# EAGLE design ModulCentralny (EAGLE 9.6.2)
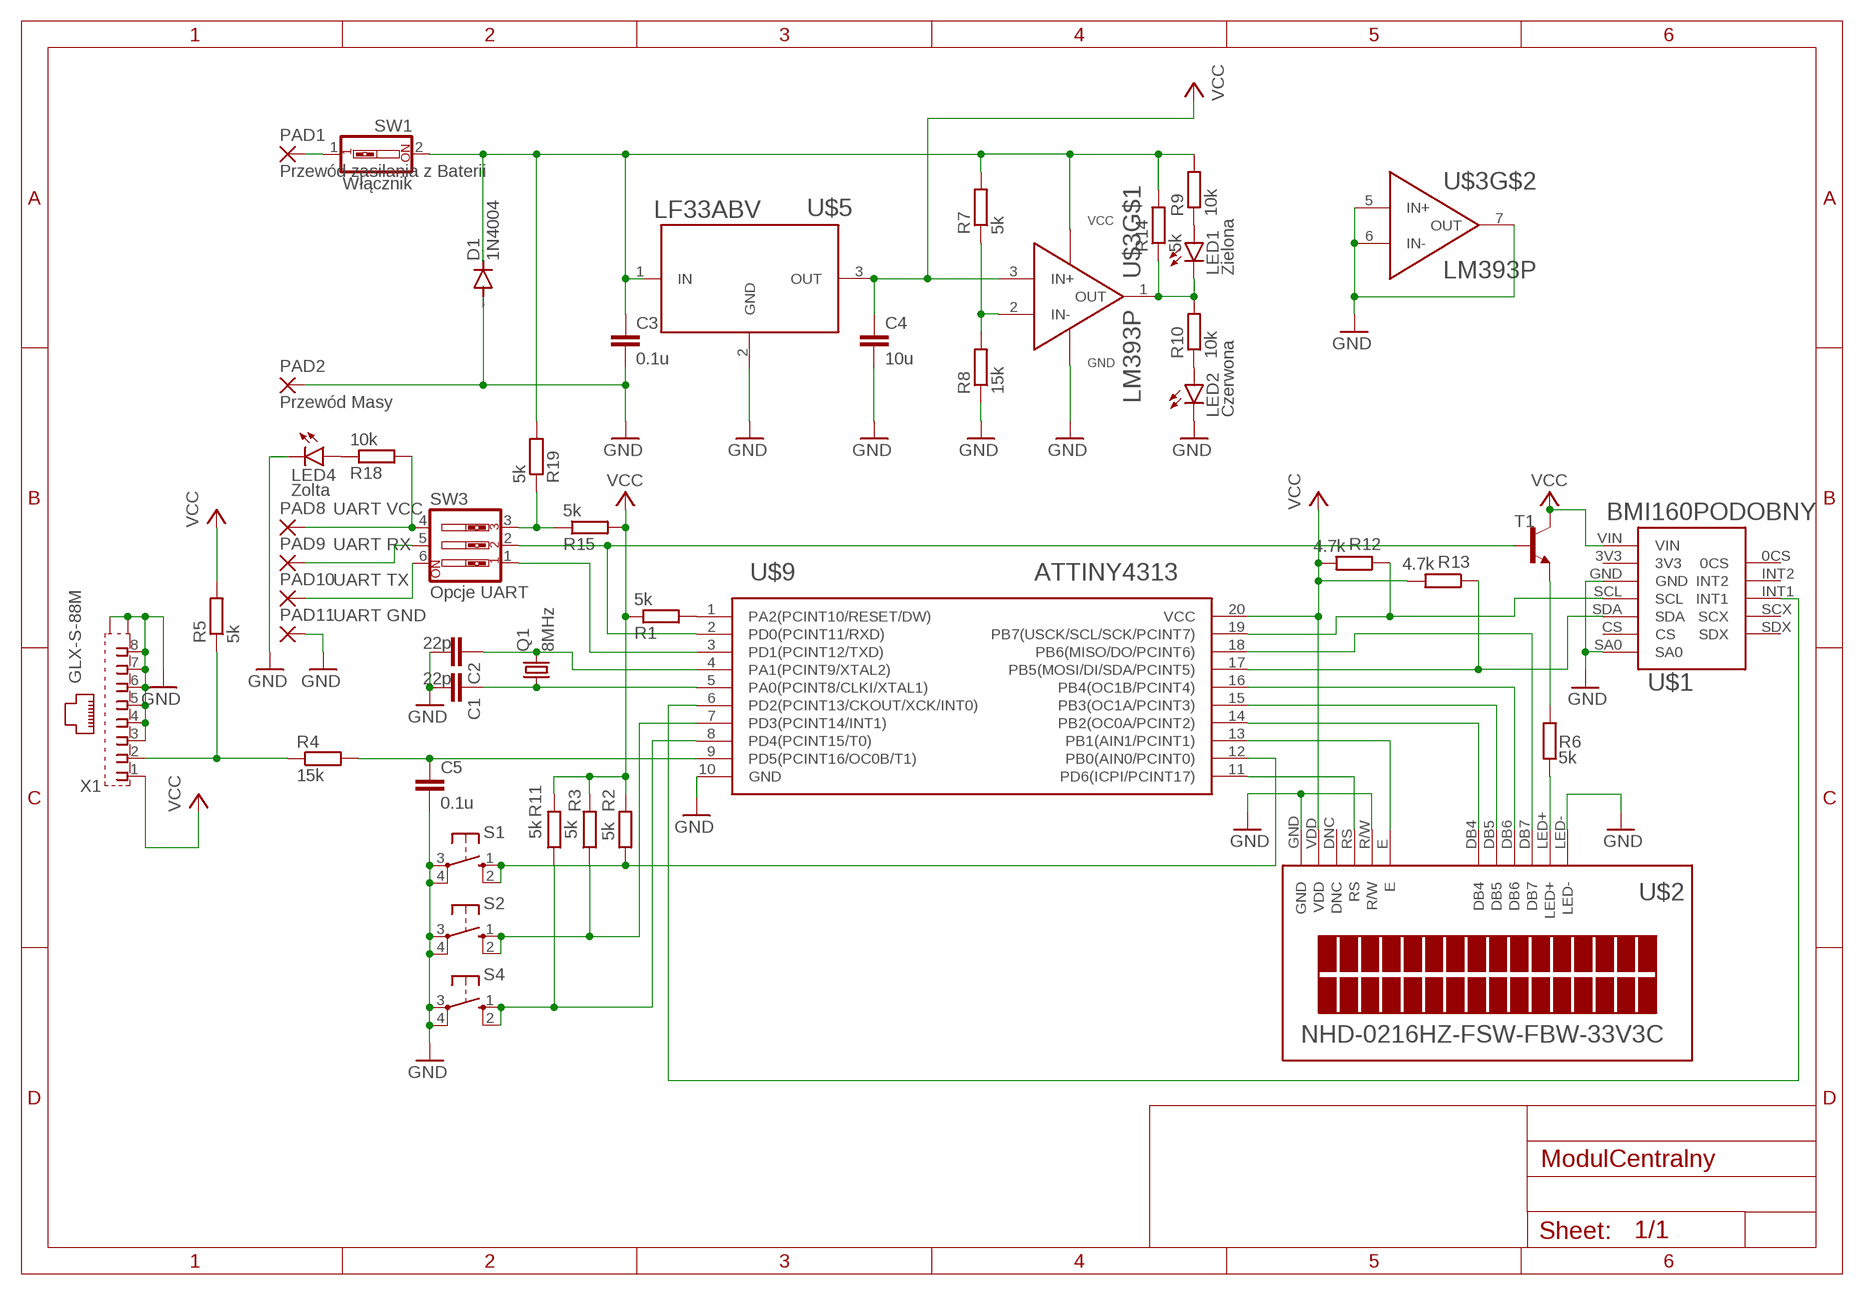
[diagram p0: schematic, sheet 1]

## Parts
C1  22p  C2,5-3  [C2.5-3]
C2  22p  C2,5-3  [C2.5-3]
C3  0.1u  C2,5-3  [C2.5-3]
C4  10u  C2,5-3  [C2.5-3]
C5  0.1u  C2,5-3  [C2.5-3]
D1  1N4004  [DO41-10]
LED1  Zielona  LED5MM  [LED5MM]
LED2  Czerwona  LED5MM  [LED5MM]
LED4  Zolta  LED5MM  [LED5MM]
PAD1  Przewód zasilania z Baterii  WIREPAD2,54/1,1  [2,54/1,1]
PAD2  Przewód Masy  WIREPAD2,54/1,1  [2,54/1,1]
PAD8  UART VCC  WIREPAD3,17/1,3  [3,17/1,3]
PAD9  UART RX  WIREPAD3,17/1,3  [3,17/1,3]
PAD10  UART TX  WIREPAD3,17/1,3  [3,17/1,3]
PAD11  UART GND  WIREPAD3,17/1,3  [3,17/1,3]
Q1  8MHz  CRYSTALHC49U70  [HC49U70]
R1  5k  R-EU_0207/7  [0207/7]
R2  5k  R-EU_0207/7  [0207/7]
R3  5k  R-EU_0207/7  [0207/7]
R4  15k  R-EU_0207/7  [0207/7]
R5  5k  R-EU_0207/7  [0207/7]
R6  5k  R-EU_0207/7  [0207/7]
R7  5k  R-EU_0207/7  [0207/7]
R8  15k  R-EU_0207/7  [0207/7]
R9  10k  R-EU_0207/7  [0207/7]
R10  10k  R-EU_0207/7  [0207/7]
R11  5k  R-EU_0207/7  [0207/7]
R12  4.7k  R-EU_0207/7  [0207/7]
R13  4.7k  R-EU_0207/7  [0207/7]
R14  5k  R-EU_0207/7  [0207/7]
R15  5k  R-EU_0207/7  [0207/7]
R18  10k  R-EU_0207/7  [0207/7]
R19  5k  R-EU_0207/7  [0207/7]
S1  10-XX  [B3F-10XX]
S2  10-XX  [B3F-10XX]
S4  10-XX  [B3F-10XX]
SW1  Włącznik  SW_DIP-1  [EDG-01]
SW3  Opcje UART  SW_DIP-3  [EDG-03]
T1  BC547B-NPN-TO92-CBE  [TO92-CBE]
U$1  BMI160PODOBNY  [BMI160MODULE]
U$2  NHD-0216HZ-FSW-FBW-33V3C  [NHD-0216HZ-FSW-FBW-33V3C]
U$3  LM393P  [R-PDIP-T8]
U$5  LF33ABV  [TO-220]
U$9  ATTINY4313  [20P3]
X1  GLX-S-88M  [GLX-S-88M]

## Nets
GND: C1.2 C2.2 C3.2 C4.2 C5.2 D1.A LED2.K(C) LED4.K(C) PAD2.1(P) PAD11.1(P) R8.1 S1.3(P) S1.4(P1) S2.3(P) S2.4(P1) S4.3(P) S4.4(P1) U$1.GND U$1.SA0 U$2.GND U$2.LED- U$2.R/W U$3.4(GND) U$3.5(IN+) U$3.6(IN-) U$3.7(OUT) U$5.2(GND) U$9.10(GND) X1.3 X1.4 X1.5 X1.6 X1.7 X1.8 X1.S1 X1.S2
N$1: R13.1 U$1.SDA U$9.17(PB5(MOSI/DI/SDA/PCINT5))
N$2: C2.1 Q1.2 U$9.4(PA1(PCINT9/XTAL2))
N$3: R1.2 U$9.1(PA2(PCINT10/RESET/DW))
N$4: R11.1 S4.1(S) S4.2(S1) U$9.8(PD4(PCINT15/T0))
N$5: U$2.DB7 U$9.18(PB6(MISO/DO/PCINT6))
N$6: U$2.DB6 U$9.16(PB4(OC1B/PCINT4))
N$7: U$2.DB5 U$9.15(PB3(OC1A/PCINT3))
N$8: U$2.DB4 U$9.14(PB2(OC0A/PCINT2))
N$9: U$2.E U$9.13(PB1(AIN1/PCINT1))
N$10: R4.1 R5.1 X1.2
N$11: PAD1.1(P) SW1.1
N$12: SW3.1 U$9.3(PD1(PCINT12/TXD))
N$13: SW3.2 T1.B U$9.2(PD0(PCINT11/RXD))
N$14: R15.1 R19.1 SW3.3
N$15: C1.1 Q1.1 U$9.5(PA0(PCINT8/CLKI/XTAL1))
N$16: R6.2 U$2.LED+
N$17: C3.1 D1.C R7.2 R9.2 R14.2 R19.2 SW1.2 U$3.8(VCC) U$5.1(IN)
N$18: R12.1 U$1.SCL U$9.19(PB7(USCK/SCL/SCK/PCINT7))
N$19: R7.1 R8.2 U$3.2(IN-)
N$20: LED1.K(C) R10.2 R14.1 U$3.1(OUT)
N$21: LED1.A R9.1
N$22: LED2.A R10.1
N$23: U$2.RS U$9.11(PD6(ICPI/PCINT17))
N$24: U$1.INT1 U$9.6(PD2(PCINT13/CKOUT/XCK/INT0))
N$25: R6.1 T1.E
N$30: C5.1 R4.2 U$9.9(PD5(PCINT16/OC0B/T1))
N$31: R3.1 S2.1(S) S2.2(S1) U$9.7(PD3(PCINT14/INT1))
N$32: R2.1 S1.1(S) S1.2(S1) U$9.12(PB0(AIN0/PCINT0))
N$34: PAD8.1(P) R18.2 SW3.4
N$35: PAD10.1(P) SW3.6
N$36: PAD9.1(P) SW3.5
N$37: LED4.A R18.1
VCC: C4.1 R1.1 R2.2 R3.2 R5.2 R11.2 R12.2 R13.2 R15.2 T1.C U$1.VIN U$2.VDD U$3.3(IN+) U$5.3(OUT) U$9.20(VCC) X1.1
Unconnected: U$1.0CS U$1.3V3 U$1.CS U$1.INT2 U$1.SCX U$1.SDX U$2.DNC

## Library data of the parts
C1-C5 = capacitor-wima:C: CAPACITOR naming: grid - package width
D1 = diode:1N4004: DIODE general purpose rectifier, 1 A
LED1 LED2 LED4 = led:LED: LED OSRAM: - CHIPLED LG R971, LG N971, LY N971, LG Q971, LY Q971, LO R971, LY R971 LH N974, LH R974 LS Q976, LO Q976, LY Q976 LO Q996 - Hyper CHIPLED LW Q18S LB Q993, LB Q99A, LB R99A - SideLED LS A670, LO A670, LY A670, LG A670, LP A670 LB A673, LV A673, LT A673, LW A673 LH A674 LY A675 LS A676, LA A676, LO A676, LY A676, LW A676 LS A679, LY A679, LG A679 - Hyper Micro SIDELED® LS Y876, LA Y876, LO Y876, LY Y876 LT Y87S - SmartLED LW L88C, LW L88S LB L89C, LB L89S, LG L890 LS L89K, LO L89K, LY L89K LS L896, LA L896, LO L896, LY L896 - TOPLED LS T670, LO T670, LY T670, LG T670, LP T670 LSG T670, LSP T670, LSY T670, LOP T670, LYG T670 LG T671, LOG T671, LSG T671 LB T673, LV T673, LT T673, LW T673 LH T674 LS T676, LA T676, LO T676, LY T676, LB T676, LH T676, LSB T676, LW T676 LB T67C, LV T67C, LT T67C, LS T67K, LO T67K, LY T67K, LW E67C LS E67B, LA E67B, LO E67B, LY E67B, LB E67C, LV E67C, LT E67C LW T67C LS T679, LY T679, LG T679 LS T770, LO T770, LY T770, LG T770, LP T770 LB T773, LV T773, LT T773, LW T773 LH T774 LS E675, LA E675, LY E675, LS T675 LS T776, LA T776, LO T776, LY T776, LB T776 LHGB T686 LT T68C, LB T68C - Hyper Mini TOPLED® LB M676 - Mini TOPLED Santana® LG M470 LS M47K, LO M47K, LY M47K Source: http://www.osram.convergy.de LUXEON: - LUMILED® LXK2-PW12-R00, LXK2-PW12-S00, LXK2-PW14-U00, LXK2-PW14-V00 LXK2-PM12-R00, LXK2-PM12-S00, LXK2-PM14-U00 LXK2-PE12-Q00, LXK2-PE12-R00, LXK2-PE12-S00, LXK2-PE14-T00, LXK2-PE14-U00 LXK2-PB12-K00, LXK2-PB12-L00, LXK2-PB12-M00, LXK2-PB14-N00, LXK2-PB14-P00, LXK2-PB14-Q00 LXK2-PR12-L00, LXK2-PR12-M00, LXK2-PR14-Q00, LXK2-PR14-R00 LXK2-PD12-Q00, LXK2-PD12-R00, LXK2-PD12-S00 LXK2-PH12-R00, LXK2-PH12-S00 LXK2-PL12-P00, LXK2-PL12-Q00, LXK2-PL12-R00 Source: www.luxeon.com KINGBRIGHT: KA-3528ASYC Source: www.kingbright.com
PAD1 PAD2 PAD8-PAD11 = wirepad:WIREPAD: Wire PAD connect wire on PCB
Q1 = crystal:CRYSTAL: CRYSTAL; OC_FARNELL: unknown; OC_NEWARK: unknown
R1-R15 R18 R19 = rcl:R-EU_: RESISTOR, European symbol; SPICEPREFIX: R
S1 S2 S4 = switch-omron:10-XX: OMRON SWITCH; MPN: B3F-1000; OC_FARNELL: 176432; OC_NEWARK: 36M3542
SW1 = special:SW_DIP-1: DIP SWITCH
SW3 = special:SW_DIP-3: DIP SWITCH
T1 = transistor:*-NPN-: NPN Transistror BF959 corrected 2008.03.06
U$1 = BezkonataktowyLicznikObrotów:BMI160PODOBNY
U$2 = BezkonataktowyLicznikObrotów:NHD-0216HZ-FSW-FBW-33V3C
U$3 = BezkonataktowyLicznikObrotów:LM393P
U$5 = BezkonataktowyLicznikObrotów:LF33ABV
U$9 = BezkonataktowyLicznikObrotów:ATTINY4313
X1 = con-kycon:GLX-S-88M: Mod. Jack, Right Angle, 8 posiotion, 8 contatcs RJ45 Source: GLX-S-88M.pdf; OC_FARNELL: unknown; OC_NEWARK: unknown

## Board
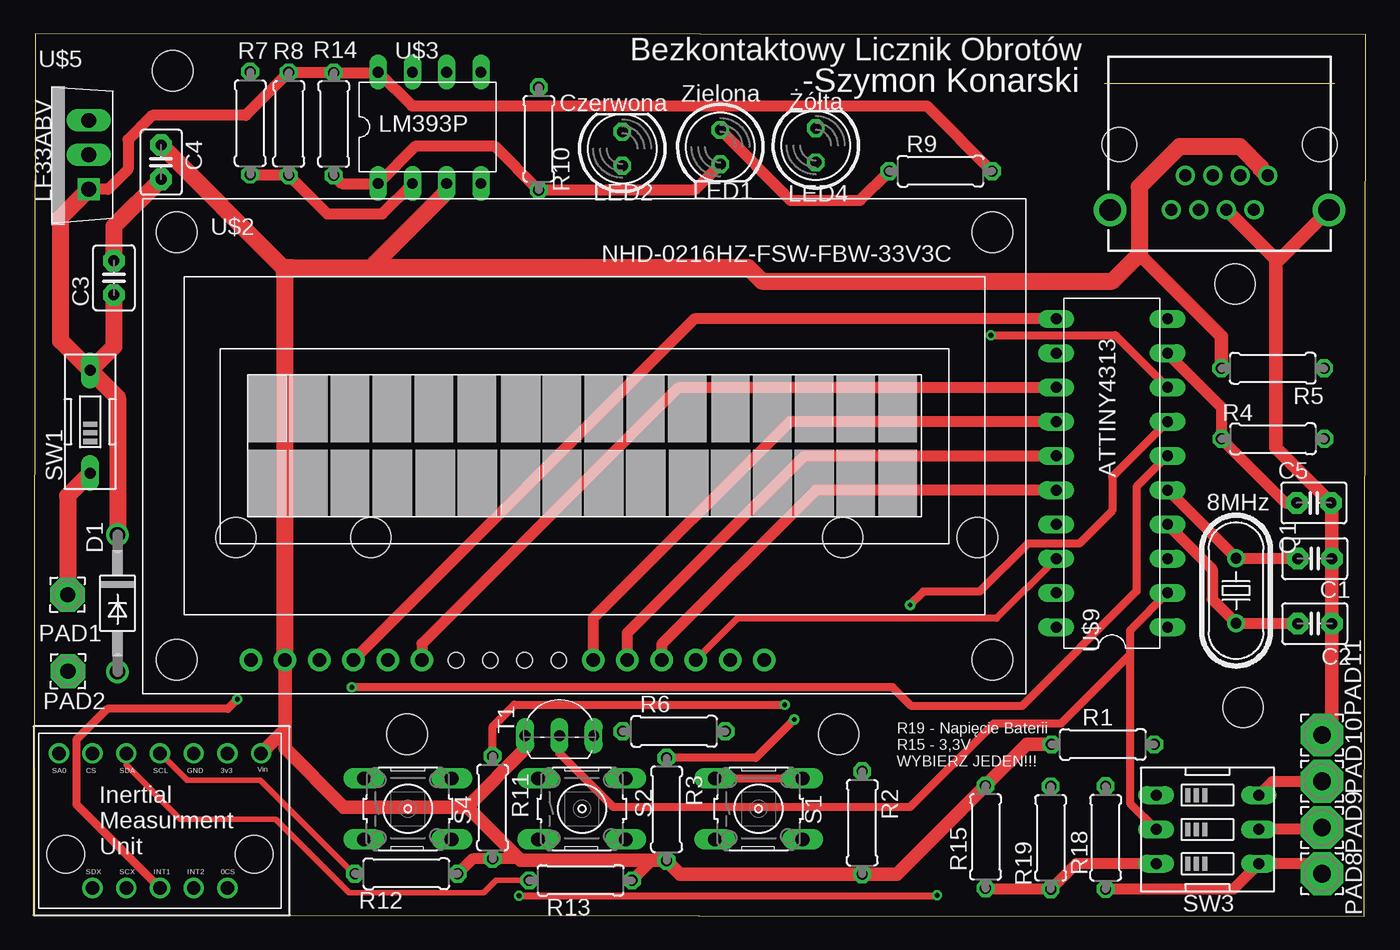
[diagram p1: board, top side]
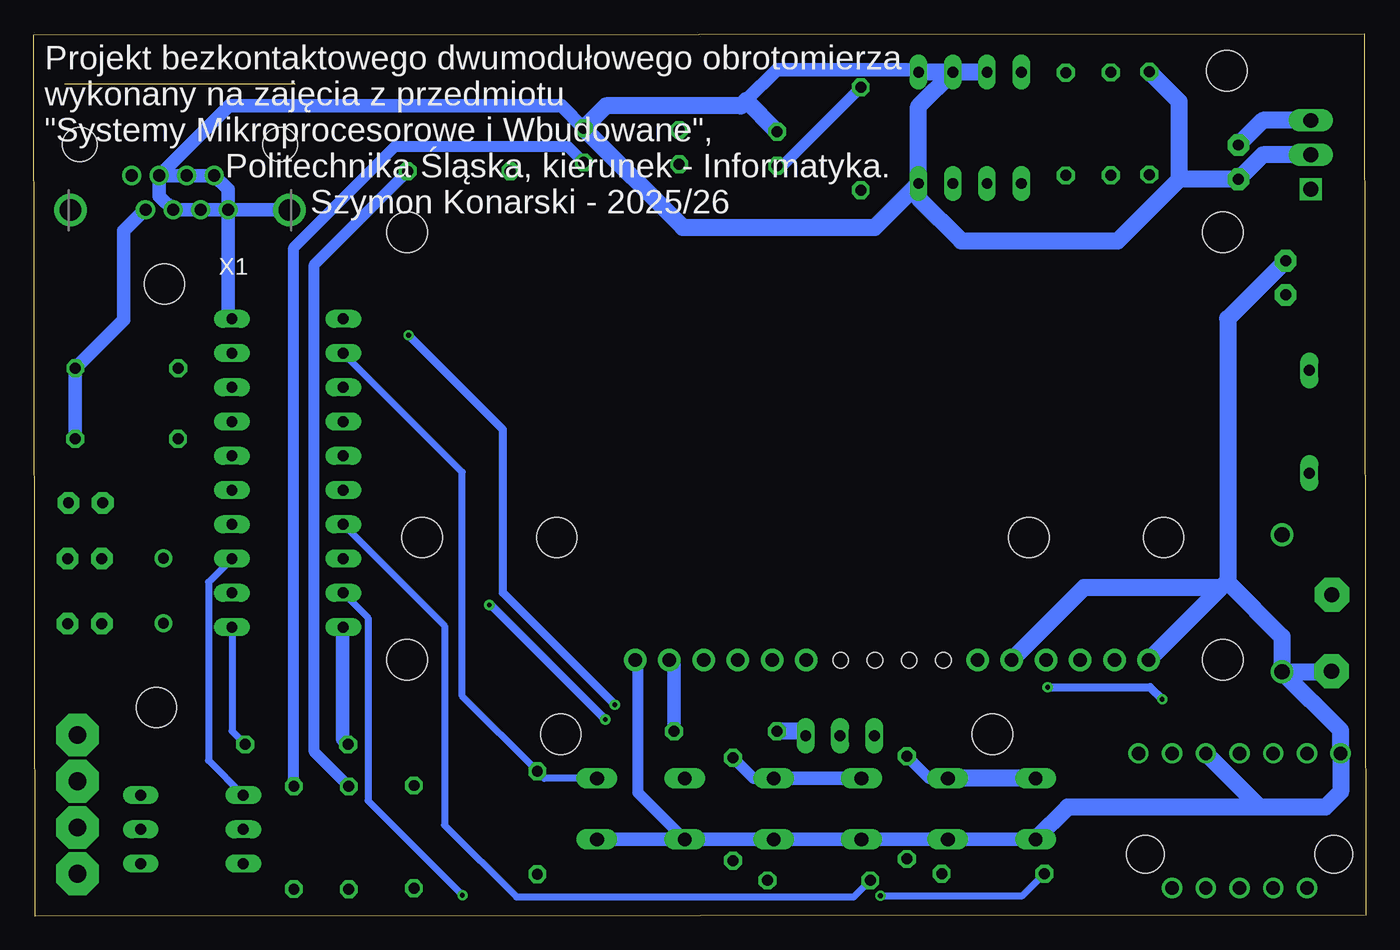
[diagram p2: board, bottom side, seen from below]

Size 98.8 x 65.42 mm. Coordinates in mm from the lower left corner, seen from the top.
Outline: 0,0.07 98.7,0 98.8,65.35 0.1,65.42 0,0.07
Copper layers (1*16): Top 0.035mm / dielectric 1.5mm / Bottom 0.035mm
Design rules "default": minimum track width 6mil, minimum drill 0.35mm, track to track 6mil, track to pad 6mil, pad to pad 6mil, via to via 6mil, smd to smd 6mil, copper to edge 40mil, drill to drill 6mil, minimum pad ring 10mil, minimum via ring 8mil, stop-mask expansion 4mil, vias tented up to drill 0mil, thermal gap 10mil
Holes 3 mm at 15,28.07 25,28.07 60,28.07 70,28.07 27.7,13.47 59.7,13.47 89.7,15.47 89.1,46.87 10.3,62.67

### Footprints (pad centres in the part's own frame; a part is rotated, then mirrored left to right if it is on the bottom)
C2.5-3 = drill 0.813 pad 1.6 octagon: 1 -1.27,0; 2 1.27,0
DO41-10 = drill 1.118: A 5.08,0; C -5.08,0
LED5MM = drill 0.813 octagon: A -1.27,0; K 1.27,0
2,54/1,1 = drill 1.118 pad 2.54 octagon: 1 0,0
3,17/1,3 = drill 1.321 pad 3.175 octagon: 1 0,0
HC49U70 = drill 0.813: 1 -2.413,0; 2 2.413,0
0207/7 = drill 0.813 octagon: 1 -3.81,0; 2 3.81,0
B3F-10XX = drill 1.016 long: 1 -3.251,2.261; 2 3.251,2.261; 3 -3.251,-2.261; 4 3.251,-2.261
EDG-01 = drill 0.813 long: 1 0,-3.81; 2 0,3.81
EDG-03 = drill 0.813 long: 1 -2.54,-3.81; 2 0,-3.81; 3 2.54,-3.81; 4 2.54,3.81; 5 0,3.81; 6 -2.54,3.81
TO92-CBE = drill 0.813 long: B 0,0; C -2.54,0; E 2.54,0
BMI160MODULE = drill 1: 0CS 5,-5; 3V3 5,5; CS -5,5; GND 2.5,5; INT1 0,-5; INT2 2.5,-5; SA0 -7.5,5; SCL 0,5; SCX -2.5,-5; SDA -2.5,5; SDX -5,-5; VIN 7.5,5 | hole 2.8: -7,-2.5; 7,-2.5
NHD-0216HZ-FSW-FBW-33V3C = drill 1 pad 1.676: DB4 0.649,-15.839; DB5 3.189,-15.839; DB6 5.729,-15.839; DB7 8.269,-15.839; DNC -19.671,-15.839; E -12.051,-15.839; GND -24.751,-15.839; LED+ 10.809,-15.839; LED- 13.349,-15.839; R/W -14.591,-15.839; RS -17.131,-15.839; VDD -22.211,-15.839 | hole 3: -30.251,-15.842; 30.249,-15.842; -30.251,15.858; 30.249,15.858 | hole 1.143: -9.525,-15.875; -6.985,-15.875; -4.445,-15.875; -1.905,-15.875
R-PDIP-T8 = drill 0.8 long: 1 -3.81,-4.191; 2 -1.27,-4.191; 3 1.27,-4.191; 4 3.81,-4.191; 5 3.81,4.064; 6 1.27,4.064; 7 -1.27,4.064; 8 -3.81,4.064
TO-220 = drill 1.1 square: 1 2.55,0 | drill 1.1 long: 2 0,0; 3 -2.55,0
20P3 = drill 0.813 long: 1 11.43,4.128; 2 8.89,4.128; 3 6.35,4.128; 4 3.81,4.128; 5 1.27,4.128; 6 -1.27,4.128; 7 -3.81,4.128; 8 -6.35,4.128; 9 -8.89,4.128; 10 -11.43,4.128; 11 -11.43,-4.128; 12 -8.89,-4.128; 13 -6.35,-4.128; 14 -3.81,-4.128; 15 -1.27,-4.128; 16 1.27,-4.128; 17 3.81,-4.128; 18 6.35,-4.128; 19 8.89,-4.128; 20 11.43,-4.128
GLX-S-88M = drill 0.9 pad 1.422: 1 -3.57,-2.3; 2 -2.55,-4.84; 3 -1.53,-2.3; 4 -0.51,-4.84; 5 0.51,-2.3; 6 1.53,-4.84; 7 2.55,-2.3; 8 3.57,-4.84 | drill 1.6 pad 2.184: S1 -8.125,-4.84; S2 8.125,-4.84 | hole 2.55: -7.44,0; 7.44,0

### Placement (x,y rotation side)
C1  95.01,26.51 0 top
C2  95.01,21.68 0 top
C3  5.95,47.32 90 top
C4  9.45,55.9 270 top
C5  94.95,30.64 0 top
D1  6.21,23.19 270 top
LED1  50.93,57.02 270 top
LED2  43.66,56.9 90 top
LED4  58.01,57.15 90 top
PAD1  2.51,23.83 0 top
PAD2  2.54,18.16 0 top
PAD8  95.55,3.14 0 top
PAD9  95.55,6.57 0 top
PAD10  95.55,10 0 top
PAD11  95.55,13.42 0 top
Q1  89.18,24.13 270 top
R1  79.3,12.73 0 top
R2  61.45,6.92 270 top
R3  46.94,7.92 270 top
R4  91.91,35.38 180 top
R5  91.9,40.62 180 top
R6  47.49,13.7 0 top
R7  18.92,58.74 90 top
R8  16.06,58.79 270 top
R9  67.26,55.23 0 top
R10  37.46,57.63 270 top
R11  34.03,8.05 270 top
R12  27.64,3.15 0 top
R13  40.56,2.65 0 top
R14  22.25,58.73 90 top
R15  70.6,5.87 90 top
R18  79.5,5.81 270 top
R19  75.43,5.8 90 top
S1  53.77,7.95 0 top
S2  40.66,7.95 0 top
S4  27.75,7.95 0 top
SW1  4.19,36.65 0 top
SW3  87.06,6.42 270 top
T1  39,13.37 0 top
U$1  9.37,7.07 0 top
U$2  40.85,34.84 0 top
U$3  29.36,58.51 0 top
U$5  4.08,56.44 270 top
U$9  79.97,32.85 270 top
X1  87.96,57.21 0 bottom

### Tracks (layer width: path | path; a pad name or v marks a point on that pad's centre or on a via)
GND
  Top 0.508: 96.28,30.57 C5.2
  Top 1.016: PAD11.1 96.28,14.15 C2.2 C1.2 96.28,30.57 | 92.12,48.71 X1.4 | C5.2 92.12,34.73 92.12,48.71 | X1.S1 92.42,48.71 92.12,48.71
  Top 1.27: C3.2 5.95,51.13 C4.2
  Bottom 0.813: U$2.LED- 54,18.8 54,9.17 S1.3
  Bottom 1.016: S4.3 S4.4 S2.3 S2.4 S1.3 S1.4 | LED4.K 59.66,60.07 84.32,60.07 X1.3 | U$3.5 33.36,62.76 43.67,62.76 45.96,60.47 46.36,60.07 | X1.3 X1.5 X1.7 84.39,53.89 X1.8 | X1.8 X1.6 X1.4 89.49,53.39 X1.3 | X1.S2 X1.8 | X1.8 84.39,44.57 U$9.10
  Bottom 1.27: 7.87,8.07 3,8.07 1.86,9.21 U$1.SA0 1.86,13.77 D1.A | 7.87,8.07 U$1.GND | C3.2 10.25,44.29 10.25,24.75 | U$3.4 33.17,53.24 30,50.07 18.4,50.07 13.84,54.63 | 13.84,54.63 C4.2 7.64,56.44 U$5.2 | U$3.4 33.17,60.03 U$3.6 | U$3.7 U$3.6 | U$3.6 U$3.5 | U$3.4 36.41,51.07 50.66,51.07 LED4.K 56.35,60.07 46.36,60.07 | LED2.K 45.96,60.47 | 13.84,54.63 13.84,60.38 R8.1 | 10.25,24.75 6.21,20.71 D1.A | D1.A 2.59,18.11 PAD2.1 | S4.3 22.11,8.07 7.87,8.07 | U$2.GND 10.75,24.35 | 10.75,24.35 10.35,24.75 10.25,24.75 | U$2.R/W 20.91,24.35 10.75,24.35
N$1
  Top 0.406: R13.1 34.29,2.65 33.37,1.73 23.41,1.73 17.95,7.19 10.88,7.19 6.87,11.21 U$1.SDA
  Bottom 0.508: U$9.17 68.33,21.52 68.33,6.75 63,1.43 37.97,1.43 R13.1
N$2
  Top 0.813: C2.1 89.21,21.68 Q1.2 87.4,23.5 87.4,25.74 U$9.4
N$3
  Bottom 0.508: U$9.1 84.1,13.72 R1.2
N$4  (via drill 0.35)
  Top 0.61: R11.1 34.03,14.05 35.66,15.67 v55.7,15.67 | v71,43.07 80.22,43.07 U$9.8
  Bottom 0.61: v55.7,15.67 64,23.97 64,36.07 v71,43.07
  Bottom 0.813: S4.2 32.38,10.21 R11.1
  Bottom 1.27: S4.1 S4.2
N$5
  Top 0.508: U$9.18 71.42,22.07 52.19,22.07 U$2.DB7
N$6
  Top 0.813: U$9.16 58.01,31.58 46.58,20.15 U$2.DB6
N$7
  Top 0.813: U$2.DB5 44.04,21 57.15,34.12 U$9.15
N$8
  Top 0.813: U$9.14 56.09,36.66 41.5,22.07 U$2.DB4
N$9
  Top 0.813: U$9.13 75.82,39.17 47.77,39.17 28.8,20.2 U$2.E
N$10
  Bottom 1.016: R4.1 95.71,35.4 R5.1 92.12,44.2 92.12,50.83 90.58,52.37 X1.2
N$11
  Top 1.27: SW1.1 2.51,31.16 PAD1.1
N$12
  Bottom 0.508: SW3.1 85.83,11.54 85.83,24.77 U$9.3
N$13
  Top 0.61: U$9.2 81.3,21.16 81.3,19.37 | SW3.2 81.3,8.37 81.3,19.37 | 81.3,19.37 76.2,14.27 71.2,14.27 65,8.07 43,8.07 39,12.07 T1.B
N$14
  Top 0.813: SW3.3 77.32,3.88 R19.1 70.67,1.99 R15.1
N$15
  Top 0.813: U$9.5 84.14,31.58 Q1.1 93.71,26.54 C1.1
N$16
  Bottom 1.016: R6.2 51.3,18.65 U$2.LED+
N$17
  Top 0.813: R9.2 66.23,60.07 28.05,60.07 U$3.8 25.51,62.54 R14.2 22.24,62.55 R7.2 15.74,59.37 8.8,59.37 7,57.57 7,55.37 5.52,53.89 U$5.1
  Top 1.27: SW1.2 2,42.65 2,51.81 U$5.1 | C3.1 5.95,42.22 SW1.2 | SW1.2 6.21,38.44 D1.C
  Bottom 0.813: R19.2 78,12.19 78,48.3 R9.2
N$18  (via drill 0.35)
  Top 0.406: R12.1 23.73,3.15 16.8,10.07 11.37,10.07 U$1.SCL
  Top 0.508: v67,1.55 66.96,1.51 v36,1.51
  Bottom 0.508: U$9.19 74,22.12 74,8.55 v67,1.55 | v36,1.51 25.46,1.51 R12.1
N$19
  Top 0.813: R8.2 18.87,54.98 R7.1 21.77,52.07 25.84,52.07 U$3.2
N$20
  Top 0.813: LED1.K 49,53.82 R10.2 34.21,57.07 28.3,57.07 U$3.1 22.85,54.32 R14.1
N$21
  Top 0.813: LED1.A 56.14,53.07 61.3,53.07 R9.1
N$22
  Bottom 0.813: R10.1 43.28,55.63 LED2.A
N$23
  Top 0.813: U$9.11 48.99,44.28 U$2.RS
N$24  (via drill 0.35)
  Top 0.61: U$9.6 81.8,31.82 81.8,24.07 73.3,15.57 65.1,15.57 63.7,16.97 v23.6,16.97 | U$1.INT1 3.15,8.28 3.15,13.08 5.45,15.37 14.4,15.37 v15.1,16.07
  Bottom 0.61: v23.6,16.97 16,16.97 v15.1,16.07
N$25
  Bottom 1.27: T1.E 41.87,13.7 R6.1
N$30
  Top 0.813: U$9.9 88.1,37.74 R4.2 92.85,30.64 C5.1
N$31  (via drill 0.35)
  Top 0.61: U$9.7 80,32.56 80,30.07 77.54,27.62 73.72,27.62 70.16,24.05 65.98,24.05 v65,23.07 | v56.4,14.57 53.56,11.73 R3.1
  Bottom 0.61: v65,23.07 64.9,23.07 v56.4,14.57
  Bottom 0.813: S2.2 45.41,10.21 R3.1
  Bottom 1.016: S2.1 S2.2
N$32
  Top 0.61: S1.1 S1.2
  Bottom 0.508: U$9.12 67.02,32.92 67.02,16.3 R2.1 60.92,10.21 S1.2
N$34
  Top 0.813: PAD8.1 94.81,3.88 SW3.4 88.99,2 R18.2
N$35
  Top 0.813: SW3.6 91.9,10 PAD10.1
N$36
  Top 0.813: PAD9.1 95.41,6.42 SW3.5
N$37
  Bottom 0.813: R18.1 79.5,49.57 72,57.07 59.2,57.07 LED4.A
VCC
  Top 0.813: R13.2 45.84,4.11 R3.2 | 36,4.24 R11.2 32.54,4.24 R12.2
  Top 1.016: R1.1 73.64,12.73 R15.2 64.03,3.11 R2.2 47.94,3.11 R3.2 46.91,4.14 36.1,4.14 36,4.24 32.16,8.07 | U$2.VDD 18.64,13.84 | 18.64,13.84 18.64,12.44 23,8.07 32.16,8.07 | 32.16,8.07 32.16,8.12 36.46,12.42 T1.C | U$1.VIN 18.64,13.84 | R5.2 88.09,42.99 82,49.07
  Top 1.27: 19.1,48.07 18.6,47.57 18.6,19.04 U$2.VDD | C4.1 9.45,57.14 18.52,48.07 19.1,48.07 | 19.1,48.07 25,48.07 | 25,48.07 53,48.07 54,47.07 80,47.07 82,49.07 82,54.07 85,57.07 89.44,57.07 90.98,55.53 90.98,55.45 X1.1 | U$3.3 30.63,53.7 25,48.07
  Bottom 1.016: R1.1 75.89,13.13 75.89,21.37 U$9.20
  Bottom 1.27: U$5.3 7.63,58.99 C4.1

### Text on the board
tPlace: Bezkontaktowy Licznik Obrotów | R19 - Napięcie Baterii / R15 - 3,3V / WYBIERZ JEDEN!!!
tNames: -Szymon Konarski | Czerwona | Zielona | Żółta | 8MHz
bNames: Projekt bezkontaktowego dwumodułowego obrotomierza / wykonany na zajęcia z przedmiotu / "Systemy Mikroprocesorowe i Wbudowane", / Politechnika Śląska, kierunek - Informatyka. / Szymon Konarski - 2025/26